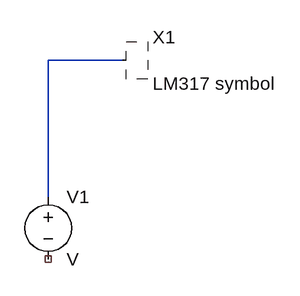
[diagram p0: schematic Draft2.asc]
Draft2.asc, the LTspice schematic file:
Version 4
SHEET 1 880 680
WIRE 144 32 48 32
WIRE 48 208 48 32
SYMBOL LM317\ symbol 208 48 R0
SYMATTR InstName X1
SYMBOL voltage 48 192 R0
SYMATTR InstName V1

The netlist it stands for:
* Draft2.asc
* X1: LM317 symbol (symbol LM317 symbol not available, pin order unknown); nets seen at it: N001
V1 N001 NC_01 V
.backanno
.end